# Altium schematic sheet POWER_SUPPLY.SchDoc
size 393 x 294 mm; SheetNumber: 4; SheetTotal: 7
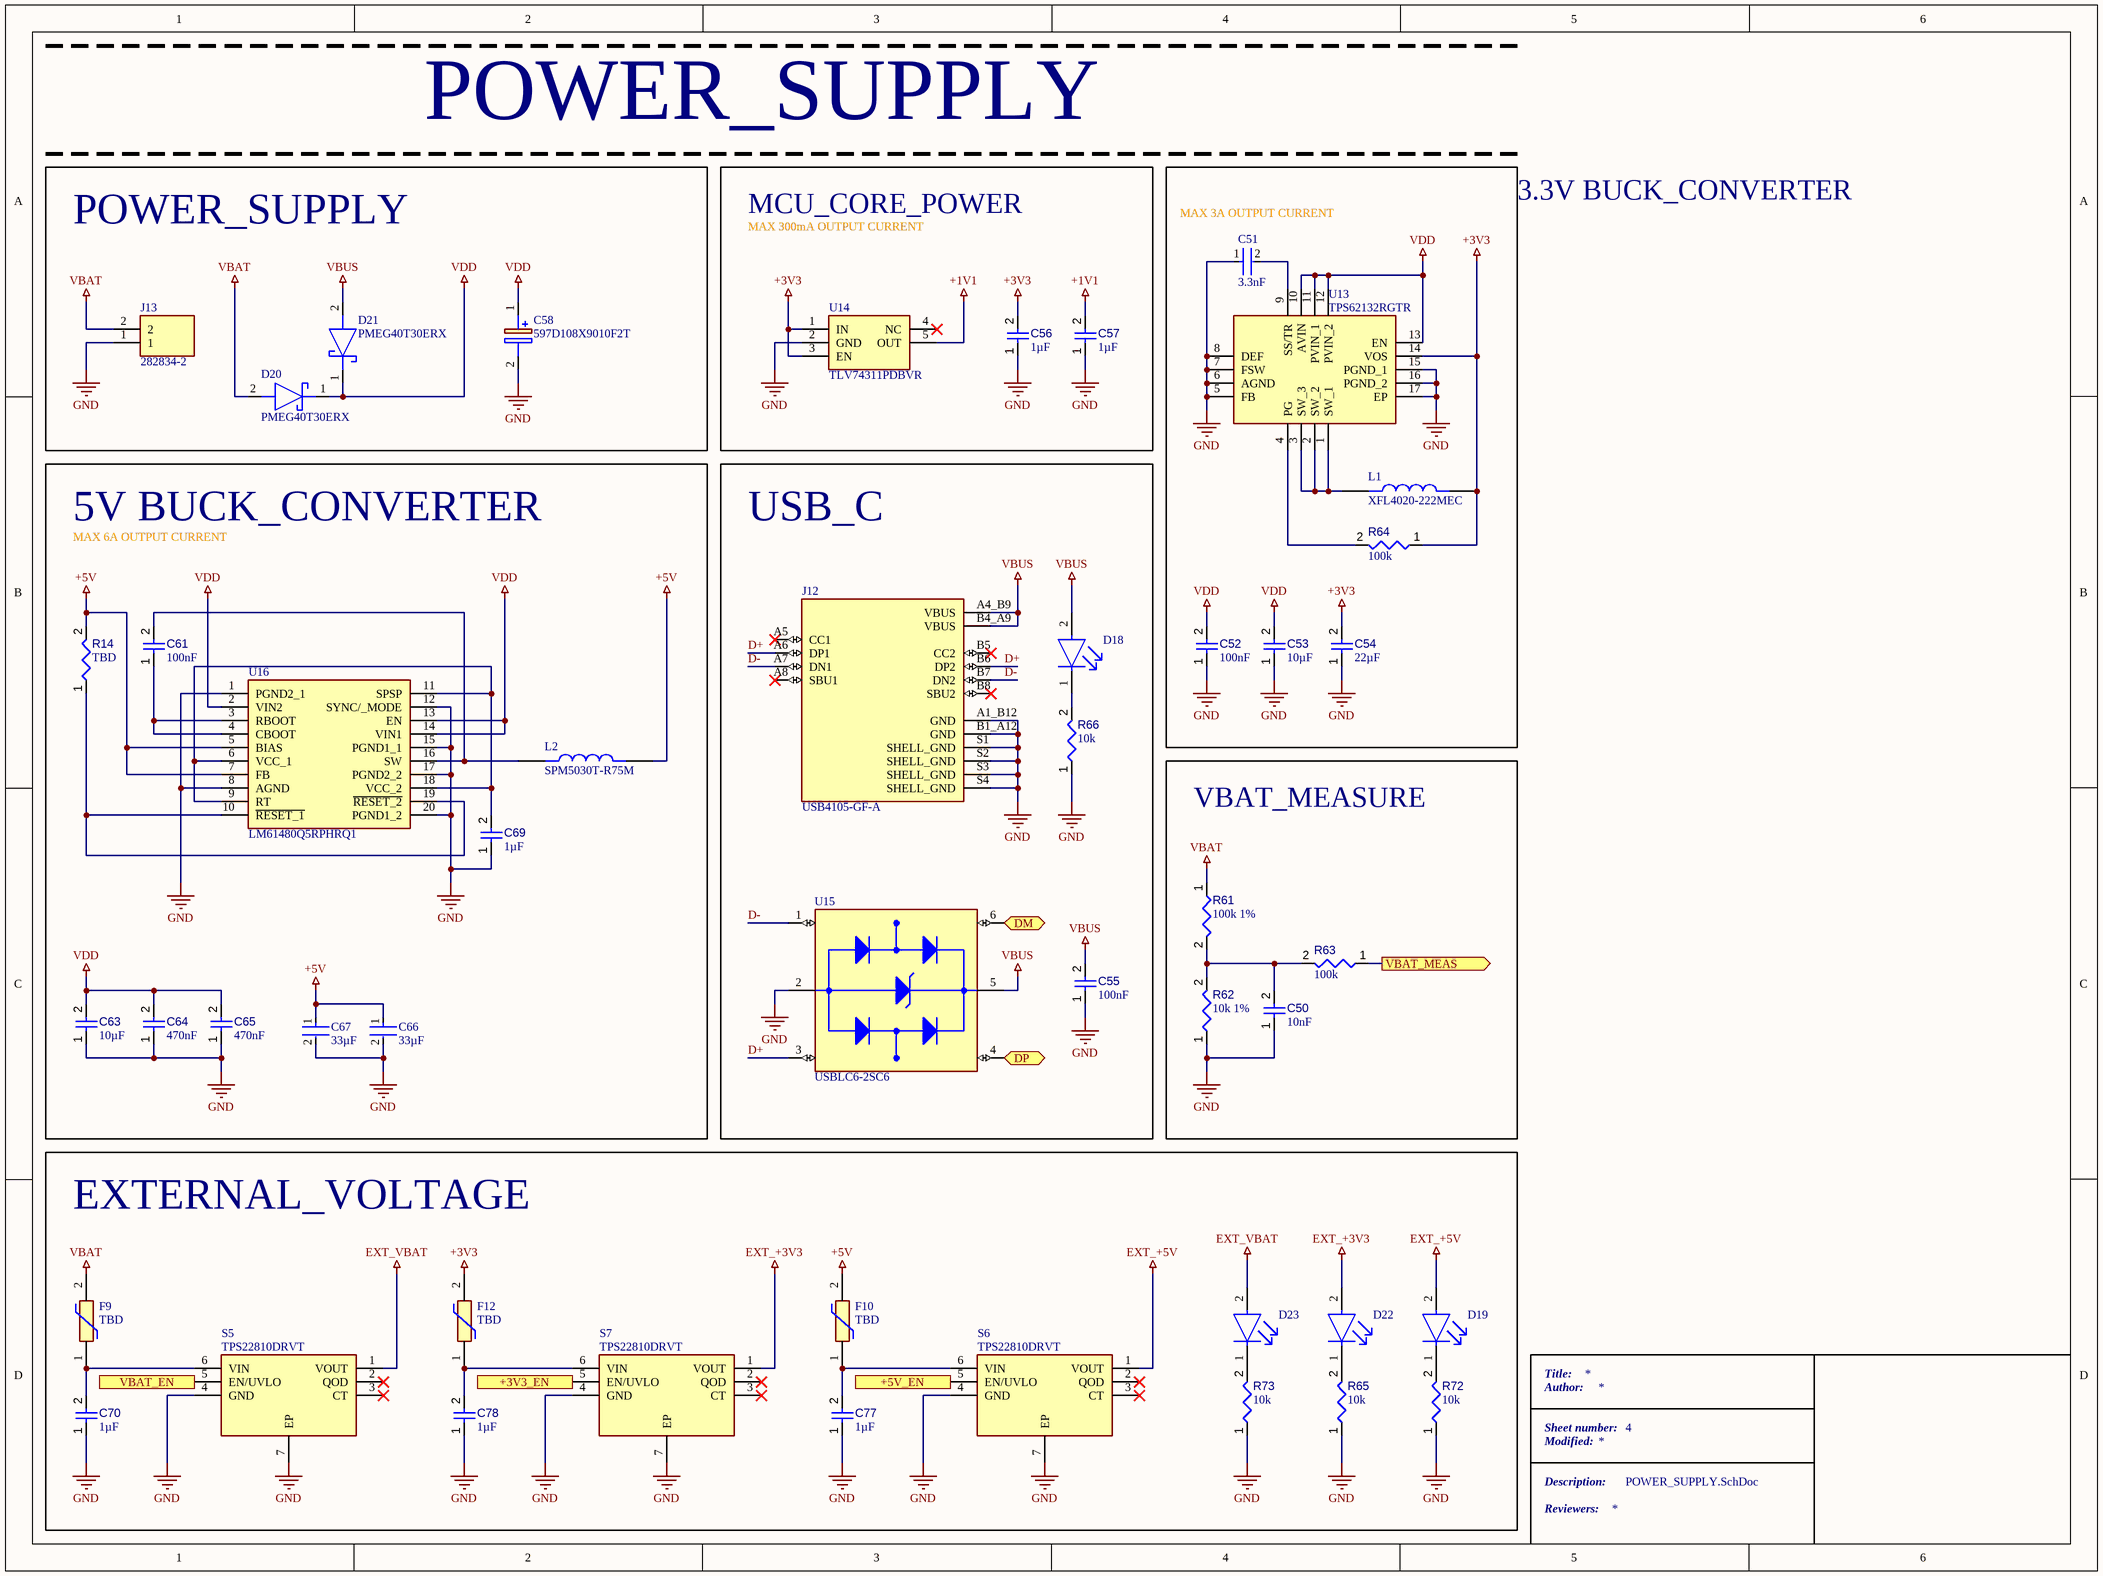
[diagram p0: POWER_SUPPLY.SchDoc]

## Parts
C50  value 10nF  [CAPC0402(1005)60_L]  (hidden comment: Capacitor 10nF +/-20% 50V 0402)
C51  3.3nF  [FP-CL388-IPC_C]
C52  value 100nF  [CAPC0402(1005)60_L]  (hidden comment: Capacitor 100nF +/-20% 10V 0402)
C53  value 10µF  [CAPC0603(1608)100_L]  (hidden comment: Capacitor 10µF +/-20% 10V 0603)
C54  value 22µF  [CAPC0805(2012)145_L]  (hidden comment: Capacitor 22µF +/-40% 16V 0805)
C55  value 100nF  [CAPC0402(1005)60_L]  (hidden comment: Capacitor 100nF +/-20% 10V 0402)
C56  value 1µF  [CAPC0402(1005)60_L]  (hidden comment: Capacitor 1µF +/-20% 10V 0402)
C57  value 1µF  [CAPC0402(1005)60_L]  (hidden comment: Capacitor 1µF +/-20% 10V 0402)
C58  597D108X9010F2T  [CAPPC5760X510N]
C61  value 100nF  [CAPC0402(1005)60_L]  (hidden comment: Capacitor 100nF +/-20% 10V 0402)
C63  value 10µF  [CAPC0603(1608)100_L]  (hidden comment: Capacitor 10µF +/-20% 10V 0603)
C64  value 470nF  [CAPC0402(1005)60_L]  (hidden comment: Capacitor 470nF +/-40% 10V 0402)
C65  value 470nF  [CAPC0402(1005)60_L]  (hidden comment: Capacitor 470nF +/-40% 10V 0402)
C66  33µF  [FP-C2012-125-0_2-IPC_A]
C67  33µF  [FP-C2012-125-0_2-IPC_A]
C69  value 1µF  [CAPC0402(1005)60_L]  (hidden comment: Capacitor 1µF +/-20% 10V 0402)
C70  value 1µF  [CAPC0402(1005)60_L]  (hidden comment: Capacitor 1µF +/-20% 10V 0402)
C77  value 1µF  [CAPC0402(1005)60_L]  (hidden comment: Capacitor 1µF +/-20% 10V 0402)
C78  value 1µF  [CAPC0402(1005)60_L]  (hidden comment: Capacitor 1µF +/-20% 10V 0402)
D18  (no value)  [FP-LTST-C191TBKT-MFG]
D19  (no value)  [FP-LTST-C191TBKT-MFG]
D20  PMEG40T30ERX  [SODFL3517X110N]
D21  PMEG40T30ERX  [SODFL3517X110N]
D22  (no value)  [FP-LTST-C191TBKT-MFG]
D23  (no value)  [FP-LTST-C191TBKT-MFG]
F9  TBD  [0402L010SLKR]
F10  TBD  [0402L010SLKR]
F12  TBD  [0402L010SLKR]
J12  USB4105-GF-A  [GCT_USB4105-GF-A]
J13  282834-2  [282834-2_1]
L1  XFL4020-222MEC  [IND_XFL4020-102MEC]
L2  SPM5030T-R75M  [IND_SPM5030T-R75M]
R14  TBD  [RESC0402(1005)_L]
R61  value 100k 1%  [RESC0402(1005)_L]  (hidden comment: Resistor 100K +/-1 % 0402 63 mW)
R62  value 10k 1%  [RESC0402(1005)_L]  (hidden comment: Resistor 10K  +/-1 % 0402 63 mW)
R63  value 100k  [RESC0402(1005)_L]  (hidden comment: Resistor 100K +/-1 % 0402 63 mW)
R64  value 100k  [RESC0402(1005)_L]  (hidden comment: Resistor 100K +/-1 % 0402 63 mW)
R65  value 10k  [RESC0402(1005)_L]  (hidden comment: Resistor 10K  +/-1 % 0402 63 mW)
R66  value 10k  [RESC0402(1005)_L]  (hidden comment: Resistor 10K  +/-1 % 0402 63 mW)
R72  value 10k  [RESC0402(1005)_L]  (hidden comment: Resistor 10K  +/-1 % 0402 63 mW)
R73  value 10k  [RESC0402(1005)_L]  (hidden comment: Resistor 10K  +/-1 % 0402 63 mW)
S5  TPS22810DRVT  [SON65P200X200X80-7N]
S6  TPS22810DRVT  [SON65P200X200X80-7N]
S7  TPS22810DRVT  [SON65P200X200X80-7N]
U13  TPS62132RGTR  [QFN50P300X300X100-17N-D]
U14  TLV74311PDBVR  [SOT95P280X145-5N]
U15  USBLC6-2SC6  [SOT95P280X145-6N]
U16  LM61480Q5RPHRQ1  [LM61480Q4RPHRQ1]

## Blocks framed on the sheet
POWER_SUPPLY: C58 D20 D21 J13
MCU_CORE_POWER: C56 C57 U14
MAX 3A OUTPUT CURRENT: C51-C54 L1 R64 U13
5V BUCK_CONVERTER: C61 C63-C67 C69 L2 R14 U16
USB_C: C55 D18 J12 R66 U15
VBAT_MEASURE: C50 R61-R63
EXTERNAL_VOLTAGE: C70 C77 C78 D19 D22 D23 F9 F10 F12 R65 R72 R73 S5-S7

## Ports
+3V3_EN (in, see MAIN_BOARD[2C], MCU[3B]), +5V_EN (in, see MAIN_BOARD[2C], MCU[3B]), DM (bidir, see MAIN_BOARD[2C], MCU[2A]), DP (bidir, see MAIN_BOARD[2C], MCU[2A]), VBAT_EN (in, see MAIN_BOARD[2C], MCU[3B]), VBAT_MEAS (out, see MAIN_BOARD[2C], MCU[3B])

## Nets
+1V1: C57.2 U14.5(OUT)
+3V3: C54.2 C56.2 F12.2 L1.1 R64.1 U13.14(VOS) U14.1(IN) U14.3(EN)
+5V: C66.1 C67.1 F10.2 L2.2 R14.2 U16.5(BIAS) U16.7(FB)
EXT_+3V3: D22.2(A) S7.1(VOUT)
EXT_+5V: D19.2(A) S6.1(VOUT)
EXT_VBAT: D23.2(A) S5.1(VOUT)
GND: C50.1 C51.1 C52.1 C53.1 C54.1 C55.1 C56.1 C57.1 C58.2(-) C63.1 C64.1 C65.1 C66.2 C67.2 C69.1 C70.1 C77.1 C78.1 J12.A1_B12(GND) J12.B1_A12(GND) J12.S1(SHELL_GND) J12.S2(SHELL_GND) J12.S3(SHELL_GND) J12.S4(SHELL_GND) J13.1 R62.1 R65.1 R66.1 R72.1 R73.1 S5.4(GND) S5.7(EP) S6.4(GND) S6.7(EP) S7.4(GND) S7.7(EP) U13.5(FB) U13.6(AGND) U13.7(FSW) U13.8(DEF) U13.15(PGND_1) U13.16(PGND_2) U13.17(EP) U14.2(GND) U15.2(GND) U16.1(PGND2_1) U16.8(AGND) U16.12(SYNC/_MODE) U16.15(PGND1_1) U16.17(PGND2_2) U16.20(PGND1_2)
VBAT: D20.2(A) F9.2 J13.2 R61.1
VBUS: C55.2 D18.2(A) D21.2(A) J12.A4_B9(VBUS) J12.B4_A9(VBUS) U15.5(VBUS)
VDD: C52.2 C53.2 C58.1(+) C63.2 C64.2 C65.2 D20.1(K) D21.1(K) U13.10(AVIN) U13.11(PVIN_1) U13.12(PVIN_2) U13.13(EN) U16.2(VIN2) U16.13(EN) U16.14(VIN1)
+3V3_EN: S7.5(EN/UVLO) ; port +3V3_EN
+5V_EN: S6.5(EN/UVLO) ; port +5V_EN
D+: J12.A6(DP1) J12.B6(DP2) U15.3(I/O2_IN)
D-: J12.A7(DN1) J12.B7(DN2) U15.1(I/O1_IN)
DM: U15.6(I/O1_OUT) ; port DM
DP: U15.4(I/O2_OUT) ; port DP
VBAT_EN: S5.5(EN/UVLO) ; port VBAT_EN
VBAT_MEAS: R63.1 ; port VBAT_MEAS
NetC50_2: C50.2 R61.2 R62.2 R63.2
NetC51_2: C51.2 U13.9(SS/TR)
NetC61_1: C61.1 U16.3(RBOOT) U16.4(CBOOT)
NetC61_2: C61.2 L2.1 U16.16(SW)
NetC69_2: C69.2 U16.6(VCC_1) U16.9(RT) U16.11(SPSP) U16.18(VCC_2)
NetC70_2: C70.2 F9.1 S5.6(VIN)
NetC77_2: C77.2 F10.1 S6.6(VIN)
NetC78_2: C78.2 F12.1 S7.6(VIN)
NetD18_1: D18.1(C) R66.2
NetD19_1: D19.1(C) R72.2
NetD22_1: D22.1(C) R65.2
NetD23_1: D23.1(C) R73.2
NetL1_2: L1.2 U13.1(SW_1) U13.2(SW_2) U13.3(SW_3)
NetR14_1: R14.1 U16.10(~{RESET_1}) U16.19(~{RESET_2})
NetR64_2: R64.2 U13.4(PG)

Not connected (* = marked no-connect by the designer): J12 A5(CC1)* A8(SBU1)* B5(CC2)* B8(SBU2)*; S5 2(QOD)* 3(CT)*; S6 2(QOD)* 3(CT)*; S7 2(QOD)* 3(CT)*; U14 4(NC)*

## Notes on the sheet
- POWER_SUPPLY
- MAX 300mA OUTPUT CURRENT
- 3.3V BUCK_CONVERTER
- MAX 6A OUTPUT CURRENT
- Title:
- Author:
- Sheet number:
- Modified:
- Description:
- Reviewers:

## Library data of the parts
C50 = CMP-001-00069-3: Chip Capacitor, 10nF +/-20%, 50V, 0402, Thickness 0.6 mm; Tolerance: 5%; Max Operating Temperature: 85°C; Pins: 2; Case/Package: 0402; Voltage Rating: 50V; Min Operating Temperature: -55°C; Mounting Technology: SMT
C51 = CMP-13271-000627-1: Cap Ceramic 3.3nF 50V X7R ±10% SMD 0402 +125°C Paper T/R; Voltage Rating: 50V; Packaging: Tape and Reel; Mount: Surface Mount; Height: 0.5mm; Dielectric: X7R; Depth: 0.5mm; Tolerance: 10%; Voltage Rating (DC): 50V; Lead Free: Lead Free; Radiation Hardening: No; Thickness: 0.022inch; Case/Package: 0402; Width: 0.02inch; Contact Plating: Tin; Max Operating Temperature: 125°C; Length: 1mm; Case Code (Imperial): 0402; Capacitance: 3.3nF; Voltage: 50V; Case Code (Metric): 1005; Min Operating Temperature: -55°C; Package Quantity: 1; Material: Ceramic
C52 C55 C61 = CMP-001-00061-3: Chip Capacitor, 100nF +/-20%, 10V, 0402, Thickness 0.6 mm; Tolerance: 20%; Mounting Technology: SMT; Voltage Rating: 10V; Max Operating Temperature: 85°C; Pins: 2; Case/Package: 0402; Min Operating Temperature: -55°C
C53 C63 = CMP-001-00075-4: Chip Capacitor, 10µF +/-20%, 10V, 0603, Thickness 1 mm; Tolerance: 10%; Voltage Rating: 10V; Max Operating Temperature: 85°C; Pins: 2; Case/Package: 0603; Mounting Technology: SMT; Min Operating Temperature: -55°C
C54 = CMP-001-00081-4: Chip Capacitor, 22µF +/-40%, 16V, 0805, Thickness 1.45 mm; Tolerance: 5%; Voltage Rating: 16V; Mounting Technology: SMT; Pins: 2; Max Operating Temperature: 85°C; Case/Package: 0805; Min Operating Temperature: -55°C
C56 C57 C69 C70 C77 C78 = CMP-001-00063-3: Chip Capacitor, 1µF +/-20%, 10V, 0402, Thickness 0.6 mm; Tolerance: 10%; Mounting Technology: SMT; Max Operating Temperature: 85°C; Voltage Rating: 10V; Pins: 2; Case/Package: 0402; Min Operating Temperature: -55°C
C58 = 597D108X9010F2T: Capacitor Polarised; Manufacturer_Name: Vishay; Datasheet Link: http://www.vishay.com/doc?40047; Height: 5.1mm; Manufacturer_Part_Number: 597D108X9010F2T; Mouser Part Number: 71-597D108X9010F2T; Mouser Price/Stock: https://www.mouser.co.uk/ProductDetail/Vishay-Sprague/597D108X9010F2T?qs=IbgLjqUpHQCfIl1FLFnbYA%3D%3D; Arrow Part Number: 597D108X9010F2T; Arrow Price/Stock: https://www.arrow.com/en/products/597d108x9010f2t/vishay?region=nac
C64 C65 = CMP-001-00060-4: Chip Capacitor, 470nF +/-40%, 10V, 0402, Thickness 0.6 mm; Tolerance: 20%; Max Operating Temperature: 85°C; Case/Package: 0402; Voltage Rating: 10V; Min Operating Temperature: -55°C; Mounting Technology: SMT; Pins: 2
C66 C67 = CMP-08246-003796-1: Multilayer Ceramic Capacitors 33μF ±20% 6.3V X5R SMD 0805; Capacitance: 33uF; Series: C; Min Operating Temperature: -55°C; Depth: 1.25mm; Radiation Hardening: No; Package Quantity: 1; Height: 1.25mm; Max Operating Temperature: 85°C; REACH SVHC: No SVHC; Mount: Surface Mount; Construction: Flat; Case/Package: 0805; Dielectric Material: Ceramic; Thickness: 0.057inch; Case Code (Imperial): 0805; Lead Free: Lead Free; Weight: 0.000194oz; Case Code (Metric): 2012; Tolerance: 20%; Dielectric: X5R; RoHS Compliant: Yes; Length: 2mm; Packaging: Tape and Reel; Voltage Rating (DC): 6.3V; Width: 1.2mm; Resistor Type: Ceramic; Termination: SMD/SMT; Voltage Rating: 6.3V
D18 D19 D22 D23 = CMP-22017-000008-1: LED BLUE CLEAR CHIP SMD; Lens Color: Colorless; Dominant Wavelength: 475nm; Forward Current: 20mA; Wavelength: 468nm; Viewing Angle: 130°; Power Dissipation: 76mW; Luminous Intensity: 180mcd; Reverse Voltage: 5V; Number of Elements: 1; Lens Style: Diffused; Forward Voltage: 3.8V; Max Power Dissipation: 75mW; Case Code (Metric): 1608; Packaging: Tape and Reel; Case/Package: 0603; Depth: 1.6mm; Mount: Surface Mount; Lead Free: Lead Free; Min Operating Temperature: -20°C; Lens Transparency: Clear; Illumination Color: Blue; Height: 0.55mm; Test Current: 20mA; Case Code (Imperial): 0603; Max Operating Temperature: 80°C; Number of Pins: 2; Length: 0.8mm; Radiation Hardening: No; Package Quantity: 1; Number of LEDs: 1; Width: 0.8mm; Color: Blue
D20 D21 = PMEG60T30ELRX: Schottky Diode; Manufacturer_Name: Nexperia; Datasheet Link: https://assets.nexperia.com/documents/data-sheet/PMEG60T30ELR.pdf; Height: 1.1mm; Manufacturer_Part_Number: PMEG60T30ELRX; Mouser Part Number: 771-PMEG60T30ELRX; Mouser Price/Stock: https://www.mouser.co.uk/ProductDetail/Nexperia/PMEG60T30ELRX?qs=MLItCLRbWswWnbT%2FWpJcxg%3D%3D; Arrow Part Number: PMEG60T30ELRX; Arrow Price/Stock: https://www.arrow.com/en/products/pmeg60t30elrx/nexperia?region=nac
F9 F10 F12 = 0402L100SLKR: Resettable Fuse; Manufacturer_Name: LITTELFUSE; Datasheet Link: https://g.componentsearchengine.com/Datasheets/1/0402L010SLKR.pdf; Height: 0.6mm; Manufacturer_Part_Number: 0402L100SLKR; Mouser Part Number: 576-0402L100SLKR; Mouser Price/Stock: https://www.mouser.co.uk/ProductDetail/Littelfuse/0402L100SLKR?qs=7MVldsJ5Uay4EIwecFafFg%3D%3D
J12 = USB4105-GF-A: USB-C (USB TYPE-C) USB 2.0 Receptacle Connector 24 (16+8 Dummy) Position Surface Mount, Right Angle; Through Hole; MF: {'manufacturer': u'GCT'}; Package: None; Price: None; Value: *; MP: USB4105-GF-A; Availability: Unavailable
J13 = 282834-2: Connector; Manufacturer_Name: TE Connectivity; Datasheet Link: https://www.te.com/commerce/DocumentDelivery/DDEController?Action=srchrtrv&DocNm=1-1773458-1_EURO_STYLE_QRG&DocType=Data+Sheet&DocLang=English&PartCntxt=282834-2&DocFormat=pdf; Manufacturer_Part_Number: 282834-2; Mouser Part Number: 571-282834-2; Mouser Price/Stock: https://www.mouser.co.uk/ProductDetail/TE-Connectivity/282834-2?qs=A%252Bip%252BNCYi6N8cVKuk8xDog%3D%3D; Arrow Part Number: 282834-2; Arrow Price/Stock: https://www.arrow.com/en/products/282834-2/te-connectivity?region=europe
L1 = XFL4020-102MEC: Power inductor, shielded, 20% tol, SMT, RoHS, halogen free; MF: {'manufacturer': u'Coilcraft'}; Package: None; Price: None; Value: *; MP: XFL4020-102MEC; Availability: Unavailable
L2 = SPM5030T-R75M: MF: {'manufacturer': u'TDK'}; Package: None; Price: None; Value: *; MP: SPM5030T-R75M; Availability: Unavailable
R14 = CMP-009-00168-3: Tolerance: 1%; Power: 63mW; Max Operating Temperature: 155°C; Min Operating Temperature: -55°C; Pins: 2; Case/Package: 0402; Value: TBD
R61 R63 R64 = CMP-009-00168-3: Chip Resistor, 100 kOhms, +/-1 %, 63 mW, -55 to 155 degC, 0402; Tolerance: 1%; Power: 63mW; Max Operating Temperature: 155°C; Min Operating Temperature: -55°C; Pins: 2; Case/Package: 0402
R62 R65 R66 R72 R73 = CMP-009-00149-3: Chip Resistor, 10 kOhms, +/-1 %, 63 mW, -55 to 125 degC, 0402; Power: 63mW; Tolerance: 1%; Min Operating Temperature: -55°C; Case/Package: 0402; Max Operating Temperature: 155°C; Pins: 2
S5-S7 = TPS22810DRVT: Switch; Manufacturer_Name: Texas Instruments; Datasheet Link: http://www.ti.com/general/docs/lit/getliterature.tsp?genericPartNumber=TPS22810&fileType=pdf; Height: 0.8mm; Manufacturer_Part_Number: TPS22810DRVT; Mouser Part Number: 595-TPS22810DRVT; Mouser Price/Stock: https://www.mouser.co.uk/ProductDetail/Texas-Instruments/TPS22810DRVT?qs=5aG0NVq1C4wtEcND0E9Qlg%3D%3D; Arrow Part Number: TPS22810DRVT; Arrow Price/Stock: https://www.arrow.com/en/products/tps22810drvt/texas-instruments?region=nac
U13 = TPS62132RGTR: Integrated Circuit; Manufacturer_Name: Texas Instruments; Datasheet Link: http://www.ti.com/lit/gpn/tps62132; Height: 1mm; Manufacturer_Part_Number: TPS62132RGTR; Mouser Part Number: 595-TPS62132RGTR; Mouser Price/Stock: https://www.mouser.co.uk/ProductDetail/Texas-Instruments/TPS62132RGTR?qs=gXEV9p%2FxLgdM8Qvmd5pchA%3D%3D; Arrow Part Number: TPS62132RGTR; Arrow Price/Stock: https://www.arrow.com/en/products/tps62132rgtr/texas-instruments
U14 = TLV70311DBVR: Integrated Circuit; Manufacturer_Name: Texas Instruments; Datasheet Link: http://www.ti.com/lit/gpn/tlv703; Height: 1.45mm; Manufacturer_Part_Number: TLV70311DBVR; Mouser Part Number: 595-TLV70311DBVR; Mouser Price/Stock: https://www.mouser.co.uk/ProductDetail/Texas-Instruments/TLV70311DBVR?qs=YCa%2FAAYMW01QIBcdppGpKA%3D%3D; Arrow Part Number: TLV70311DBVR; Arrow Price/Stock: https://www.arrow.com/en/products/tlv70311dbvr/texas-instruments
U15 = USBLC6-2SC6: <a href="https://pricing.snapeda.com/parts/USBLC6-2SC6/STMicroelectronics/view-part?ref=eda">Check availability</a>  <a href="https://pricing.snapeda.com/parts/USBLC6-2SC6/STMicroelectronics/view-part?ref=eda">Check availability</a>; MF: {'manufacturer': u'STMicroelectronics'}; Package: None; MP: USBLC6-2SC6; Value: *; Price: None; Availability: Unavailable
U16 = LM61480Q5RPHRQ1: Integrated Circuit; Manufacturer_Name: Texas Instruments; Datasheet Link: https://www.ti.com/lit/ds/symlink/lm62460-q1.pdf?HQS=dis-mous-null-mousermode-dsf-pf-null-wwe&ts=1692068705145&ref_url=https%253A%252F%252Fth.mouser.com%252F; Height: 1mm; Manufacturer_Part_Number: LM61480Q5RPHRQ1; Mouser Part Number: 595-LM61480Q5RPHRQ1; Mouser Price/Stock: https://www.mouser.co.uk/ProductDetail/Texas-Instruments/LM61480Q5RPHRQ1?qs=Wj%2FVkw3K%252BMDu%252B1Udc40Oyw%3D%3D; Arrow Part Number: LM61480Q5RPHRQ1; Arrow Price/Stock: https://www.arrow.com/en/products/lm61480q5rphrq1/texas-instruments?region=nac